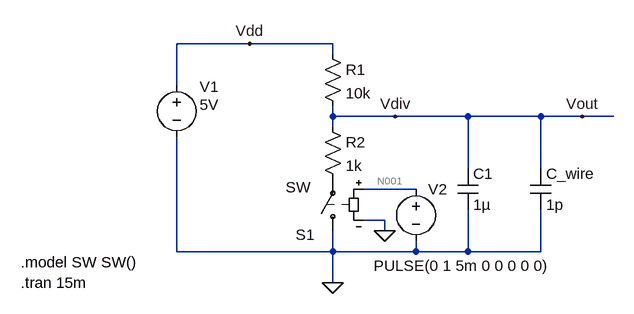
[diagram p0: schematic voltage_divider.asc]
voltage_divider.asc, the LTspice schematic file:
Version 4
SHEET 1 880 680
WIRE 0 -16 -112 -16
WIRE 128 -16 0 -16
WIRE 128 0 128 -16
WIRE -112 48 -112 -16
WIRE 128 96 128 80
WIRE 224 96 128 96
WIRE 336 96 224 96
WIRE 448 96 336 96
WIRE 512 96 448 96
WIRE 560 96 512 96
WIRE 128 112 128 96
WIRE 336 176 336 96
WIRE 448 176 448 96
WIRE 256 208 176 208
WIRE 208 256 176 256
WIRE 208 272 208 256
WIRE -112 304 -112 128
WIRE 128 304 128 272
WIRE 128 304 -112 304
WIRE 256 304 256 288
WIRE 256 304 128 304
WIRE 336 304 336 240
WIRE 336 304 256 304
WIRE 448 304 448 240
WIRE 448 304 336 304
WIRE 128 352 128 304
FLAG 128 352 0
FLAG 0 -16 Vdd
FLAG 224 96 Vdiv
FLAG 208 272 0
FLAG 512 96 Vout
SYMBOL cap 320 176 R0
SYMATTR InstName C1
SYMATTR Value 1µ
SYMATTR SpiceLine V=2.5 Irms=0 Rser=0 Lser=0 mfg="Murata" pn="GRM155R60E475ME76" type="X5R"
SYMBOL res 112 -16 R0
SYMATTR InstName R1
SYMATTR Value 10k
SYMATTR SpiceLine tol=1 pwr=0.1
SYMBOL res 112 96 R0
SYMATTR InstName R2
SYMATTR Value 1k
SYMATTR SpiceLine tol=1 pwr=0.1
SYMBOL voltage -112 32 R0
WINDOW 0 35 18 Left 2
WINDOW 123 0 0 Left 0
WINDOW 39 0 0 Left 0
WINDOW 3 35 46 Left 2
SYMATTR InstName V1
SYMATTR Value 5V
SYMBOL cap 432 176 R0
SYMATTR InstName C_wire
SYMATTR Value 1p
SYMBOL sw 128 288 R180
WINDOW 0 28 10 Left 2
WINDOW 3 34 83 Left 2
SYMATTR InstName S1
SYMBOL voltage 256 192 R0
WINDOW 0 19 16 Left 2
WINDOW 3 -65 134 Left 2
WINDOW 123 0 0 Left 0
WINDOW 39 0 0 Left 0
SYMATTR InstName V2
SYMATTR Value PULSE(0 1 5m 0 0 0 0 0)
TEXT -352 320 Left 2 !.model SW SW()
TEXT -352 352 Left 2 !.tran 15m

The netlist it stands for:
* voltage_divider.asc
C1 Vout 0 1µ V=2.5 Irms=0 Rser=0 Lser=0 mfg="Murata" pn="GRM155R60E475ME76" type="X5R"
R1 Vdd Vout 10k tol=1 pwr=0.1
R2 Vout P001 1k tol=1 pwr=0.1
V1 Vdd 0 5V
C_wire Vout 0 1p
S1 0 P001 N001 0 SW
V2 N001 0 PULSE(0 1 5m 0 0 0 0 0)
.model SW SW()
.tran 15m
.backanno
.end

* Results of the author's LTspice run, read from the files saved beside the schematic
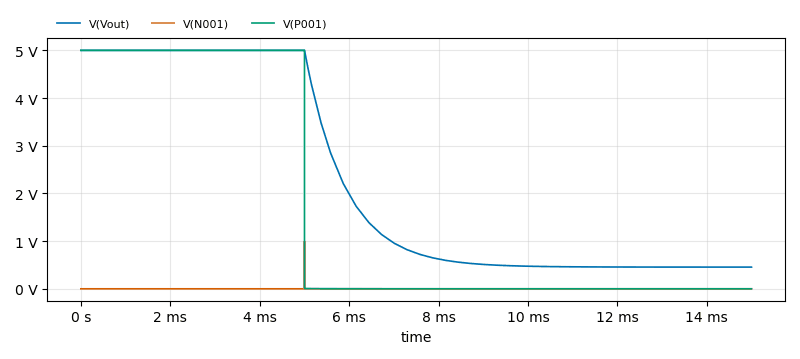
[diagram p1: Transient Analysis of voltage_divider.asc, plotted from the saved traces]
* Transient Analysis, 1 run:
*   V(Vout): min 455 mV, max 5 V, average 2.247 V, rms 3.06 V, last 455 mV
*   V(N001): min 0 V, max 1 V, average 666.7 nV, rms 771.1 µV, last 0 V
*   V(P001): min 454.6 µV, max 5 V, average 1.667 V, rms 2.887 V, last 454.6 µV